# Altium schematic sheet INC-MBTMC429-01.SchDoc
size A1
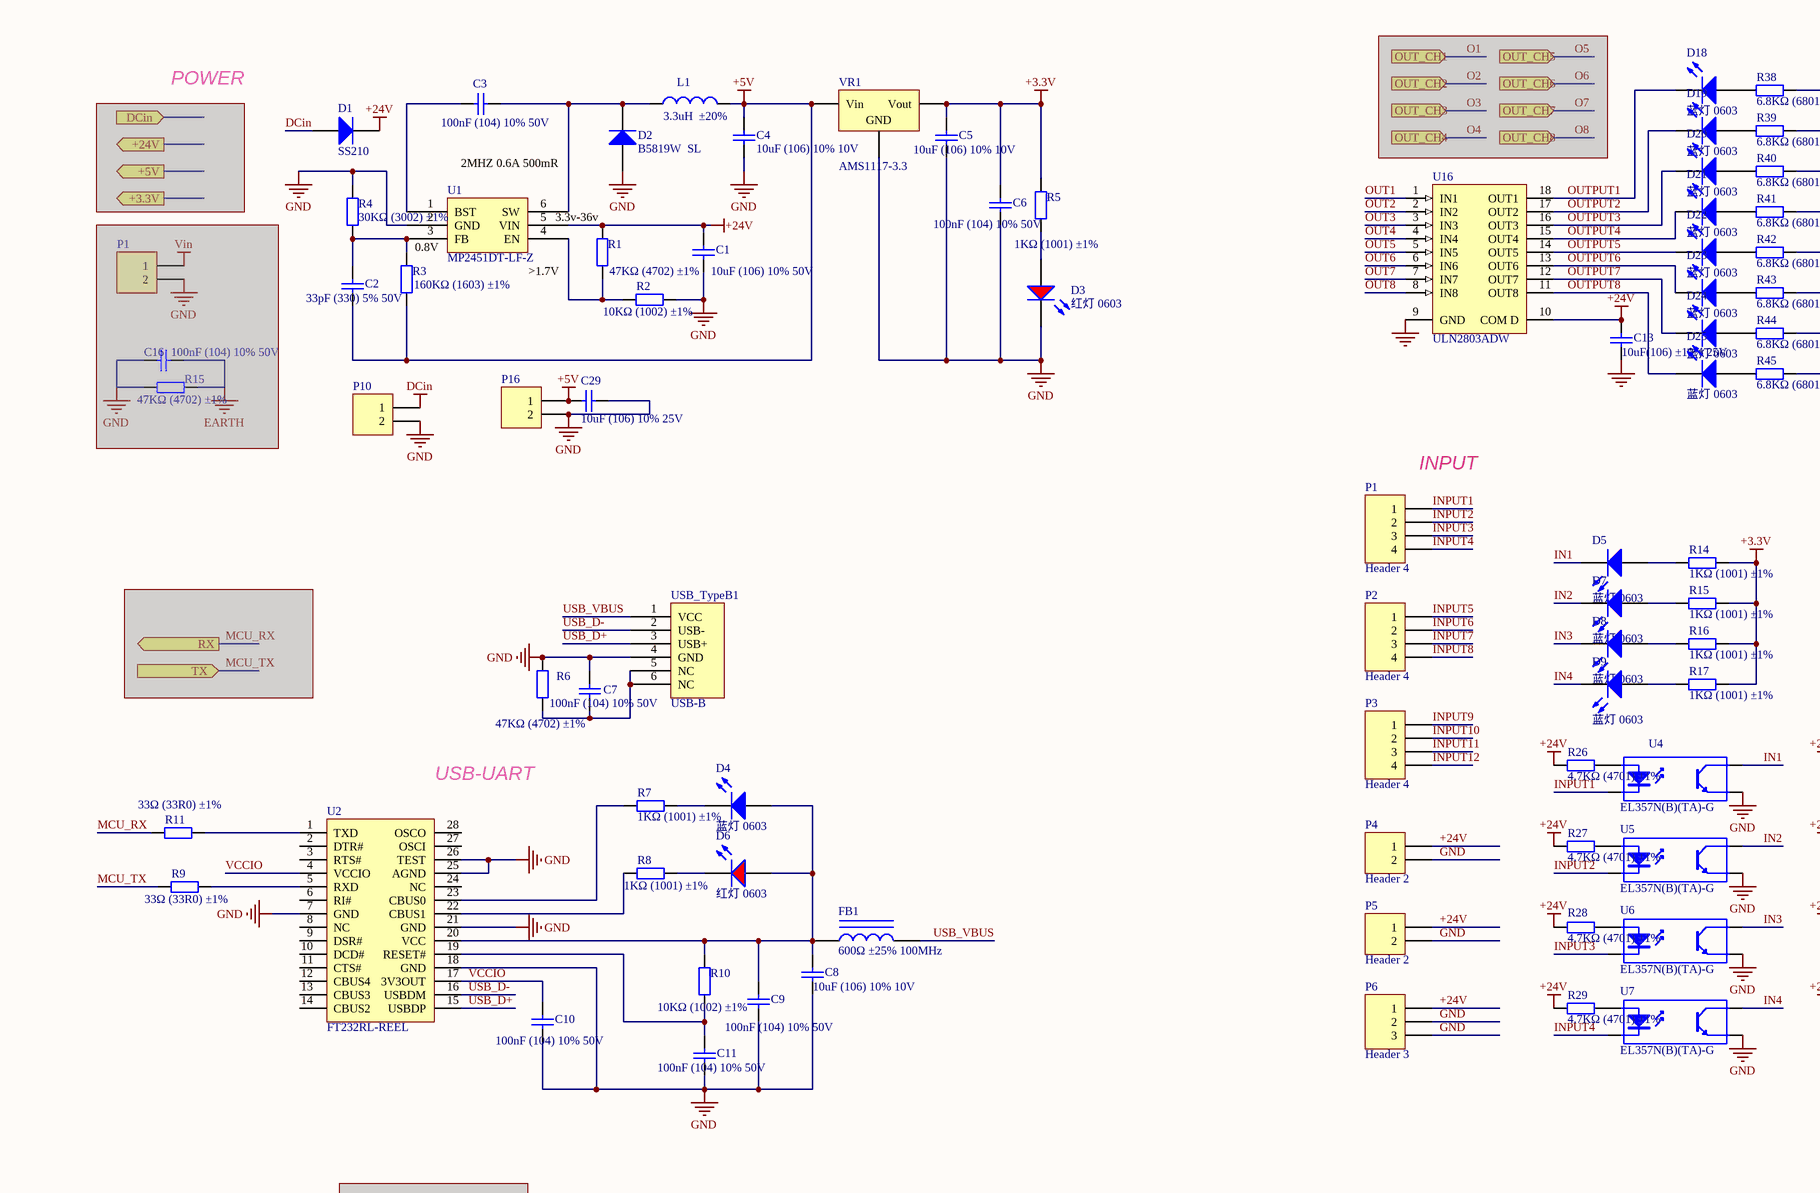
[diagram p0: INC-MBTMC429-01.SchDoc, top left]
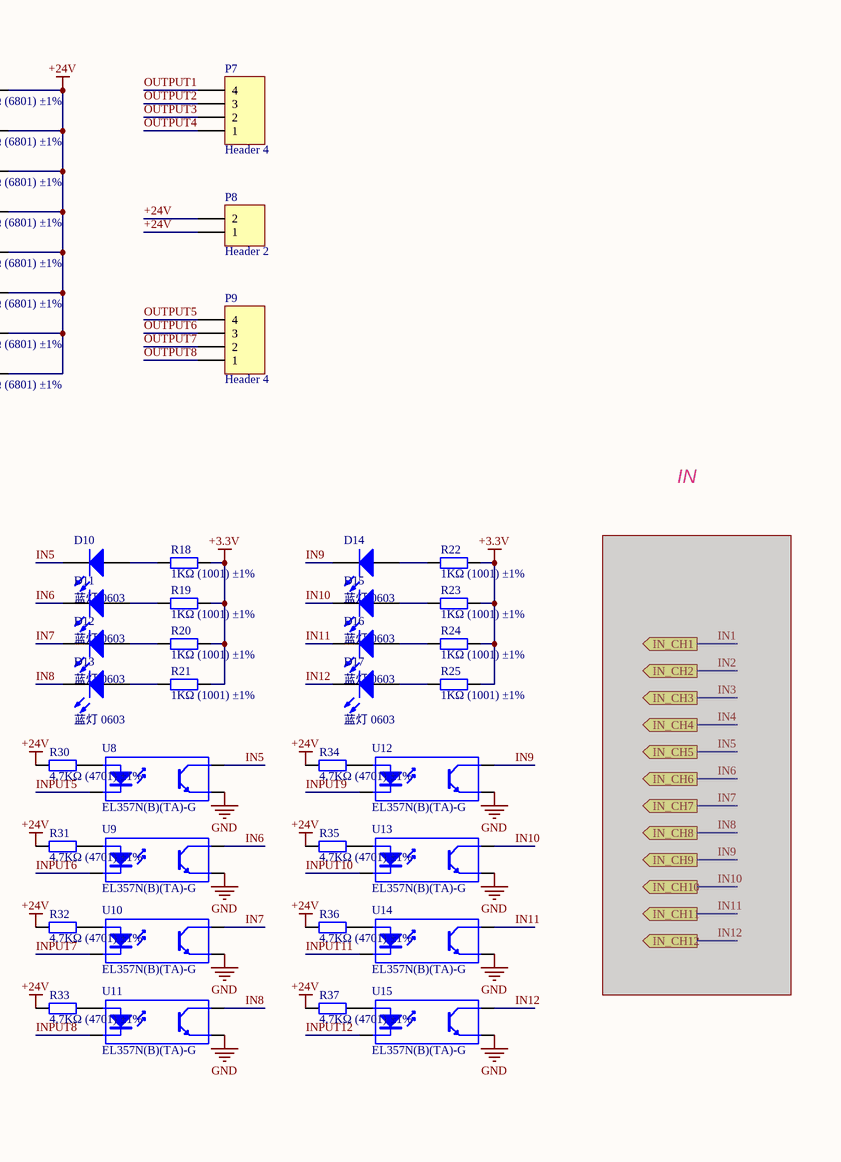
[diagram p1: INC-MBTMC429-01.SchDoc, top right]
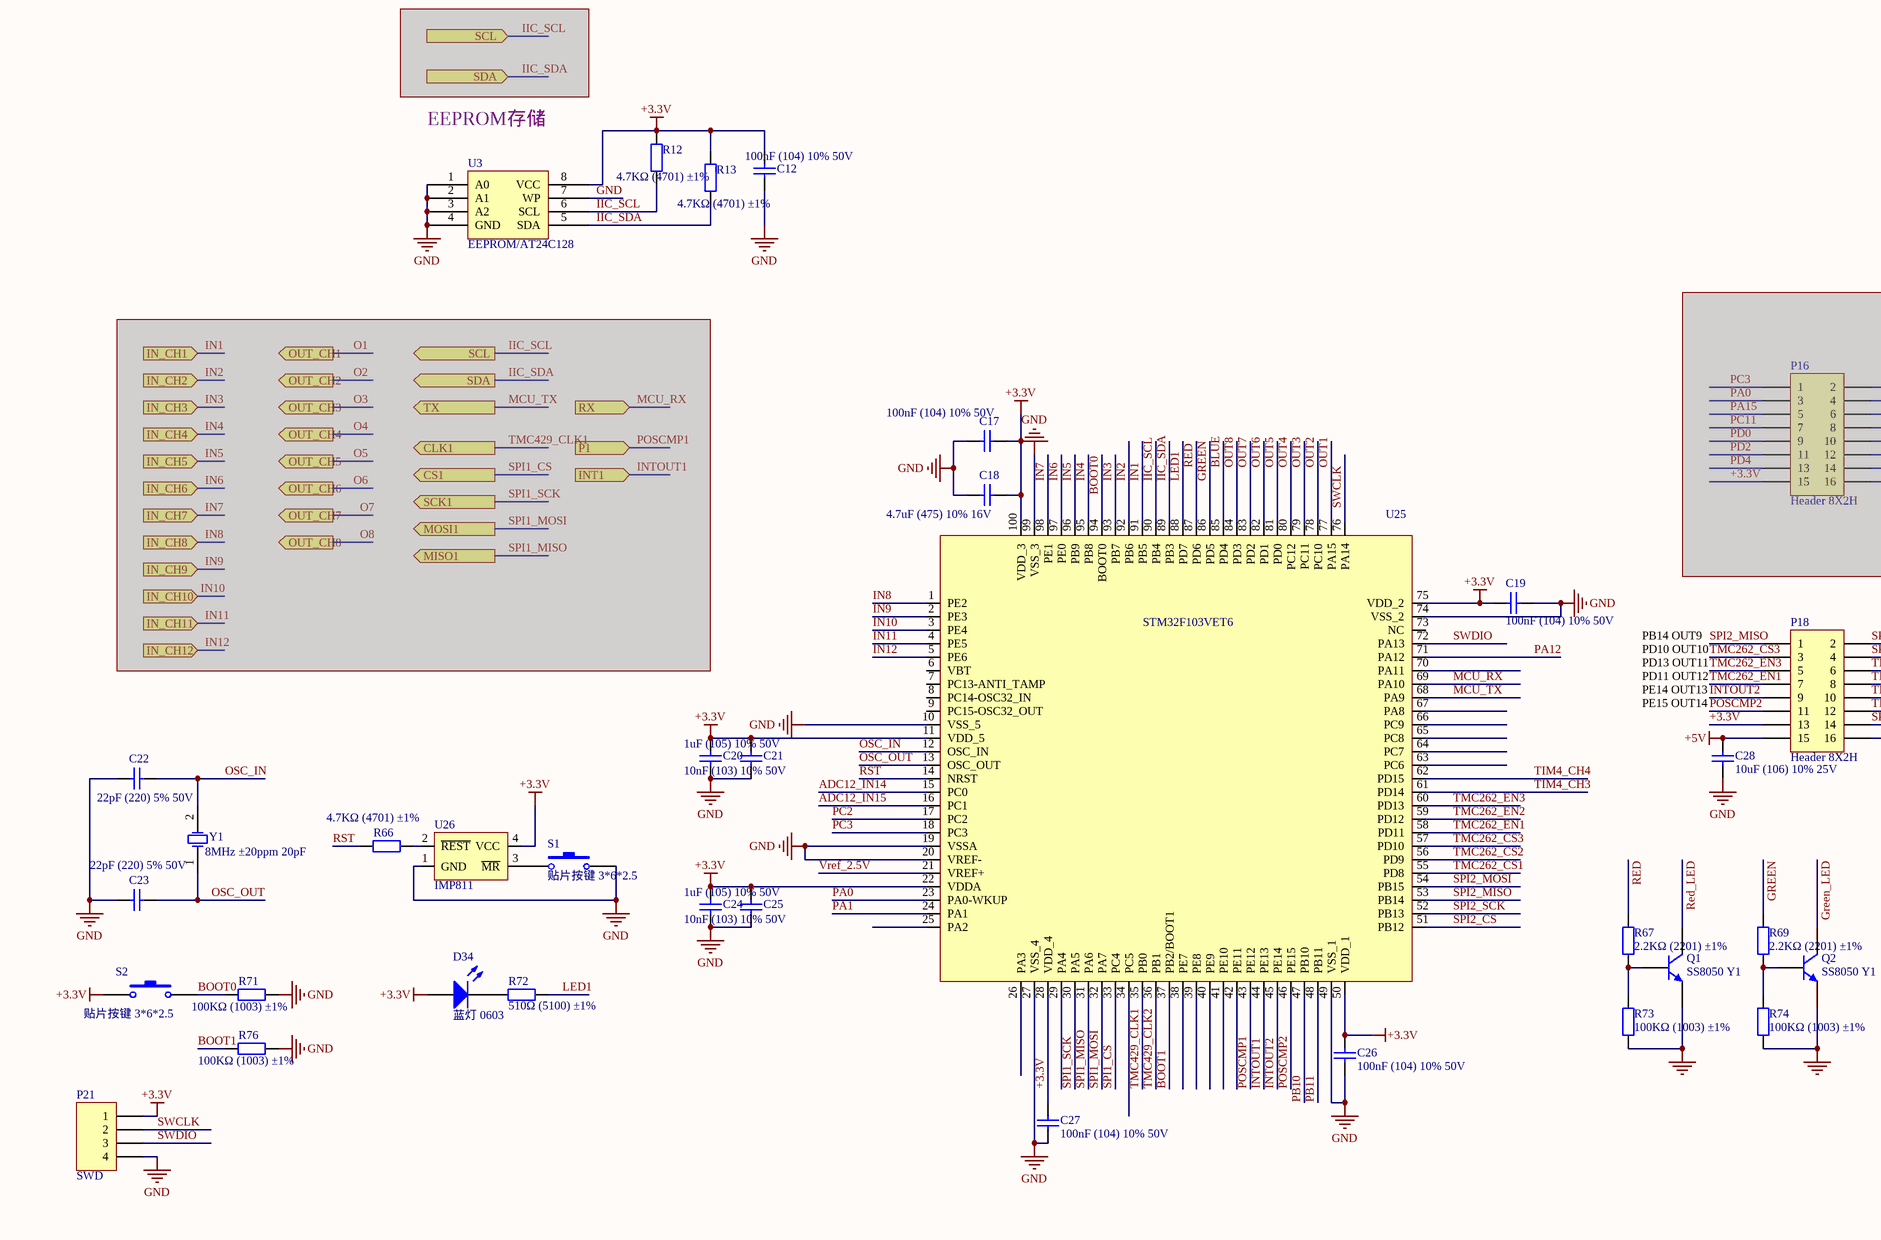
[diagram p2: INC-MBTMC429-01.SchDoc, bottom left]
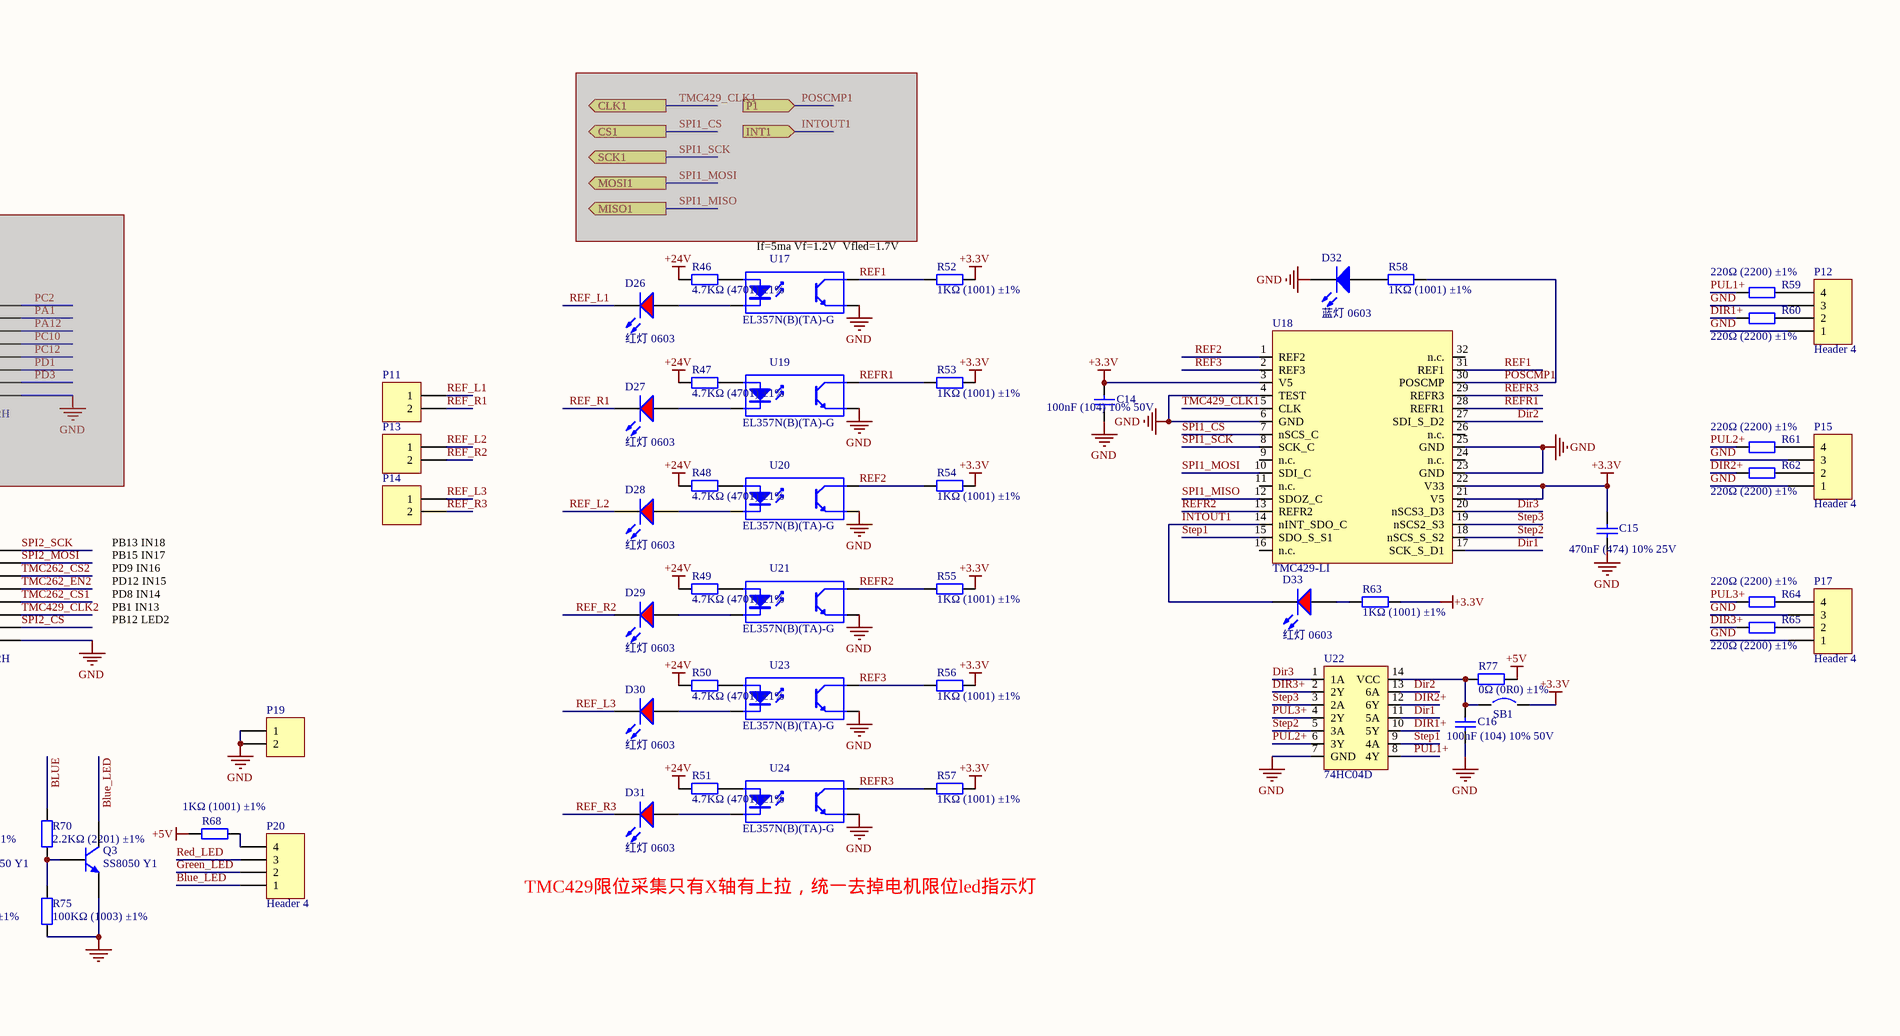
[diagram p3: INC-MBTMC429-01.SchDoc, bottom right]

## Parts
(Parts that share a designator on the sheet are numbered #1, #2 ... from top to bottom, then left to right.)
C1  10uF (106) 10% 50V  [1206_C]
C2  33pF (330) 5% 50V  [0603_C]
C3  100nF (104) 10% 50V  [0603_C]
C4  10uF (106) 10% 10V  [0603_C]
C5  10uF (106) 10% 10V  [0603_C]
C6  100nF (104) 10% 50V  [0603_C]
C7  100nF (104) 10% 50V  [0603_C]
C8  10uF (106) 10% 10V  [0603_C]
C9  100nF (104) 10% 50V  [0603_C]
C10  100nF (104) 10% 50V  [0603_C]
C11  100nF (104) 10% 50V  [0603_C]
C12  100nF (104) 10% 50V  [0603_C]
C13  10uF(106) ±10% 25V  [1206_C]
C14  100nF (104) 10% 50V  [0603_C]
C15  470nF (474) 10% 25V  [0603_C]
C16#1  100nF (104) 10% 50V  [0603_C]  (masked out: inside a compile mask, not in the netlist)
C16#2  100nF (104) 10% 50V  [0603_C]
C17  100nF (104) 10% 50V  [0603_C]
C18  4.7uF (475) 10% 16V  [0603_C]
C19  100nF (104) 10% 50V  [0603_C]
C20  1uF (105) 10% 50V  [0603_C]
C21  10nF (103) 10% 50V  [0603_C]
C22  22pF (220) 5% 50V  [0603_C]
C23  22pF (220) 5% 50V  [0603_C]
C24  1uF (105) 10% 50V  [0603_C]
C25  10nF (103) 10% 50V  [0603_C]
C26  100nF (104) 10% 50V  [0603_C]
C27  100nF (104) 10% 50V  [0603_C]
C28  10uF (106) 10% 25V  [0805_C]
C29  10uF (106) 10% 25V  [0805_C]
D1  SS210  [SMA(DO-214AC)_S1]
D2  B5819W  SL  [SOD-123]
D3  红灯 0603  [0603_LED_S1]
D4  蓝灯 0603  [0603_LED_S1]
D5  蓝灯 0603  [0603_LED_S1]
D6  红灯 0603  [0603_LED_S1]
D7  蓝灯 0603  [0603_LED_S1]
D8  蓝灯 0603  [0603_LED_S1]
D9  蓝灯 0603  [0603_LED_S1]
D10  蓝灯 0603  [0603_LED_S1]
D11  蓝灯 0603  [0603_LED_S1]
D12  蓝灯 0603  [0603_LED_S1]
D13  蓝灯 0603  [0603_LED_S1]
D14  蓝灯 0603  [0603_LED_S1]
D15  蓝灯 0603  [0603_LED_S1]
D16  蓝灯 0603  [0603_LED_S1]
D17  蓝灯 0603  [0603_LED_S1]
D18  蓝灯 0603  [0603_LED_S1]
D19  蓝灯 0603  [0603_LED_S1]
D20  蓝灯 0603  [0603_LED_S1]
D21  蓝灯 0603  [0603_LED_S1]
D22  蓝灯 0603  [0603_LED_S1]
D23  蓝灯 0603  [0603_LED_S1]
D24  蓝灯 0603  [0603_LED_S1]
D25  蓝灯 0603  [0603_LED_S1]
D26  红灯 0603  [0603_LED_S1]
D27  红灯 0603  [0603_LED_S1]
D28  红灯 0603  [0603_LED_S1]
D29  红灯 0603  [0603_LED_S1]
D30  红灯 0603  [0603_LED_S1]
D31  红灯 0603  [0603_LED_S1]
D32  蓝灯 0603  [0603_LED_S1]
D33  红灯 0603  [0603_LED_S1]
D34  蓝灯 0603  [0603_LED_S1]
FB1  600Ω ±25% 100MHz  [0805_L]
L1  3.3uH  ±20%  [L5020]
P1#1  Header 2  [15EDG-2P-3.81]  (value not drawn)  (masked out: inside a compile mask, not in the netlist)
P1#2  Header 4  [WJ15EDGVC-3.81-4P]
P2  Header 4  [WJ15EDGVC-3.81-4P]
P3  Header 4  [WJ15EDGVC-3.81-4P]
P4  Header 2  [WJ15EDGVC-3.81-2P]
P5  Header 2  [WJ15EDGVC-3.81-2P]
P6  Header 3  [WJ15EDGVC-3.81-3P]
P7  Header 4  [WJ15EDGVC-3.81-4P]
P8  Header 2  [WJ15EDGVC-3.81-2P]
P9  Header 4  [WJ15EDGVC-3.81-4P]
P10  Header 2  [WJ15EDGVC-3.81-2P]  (value not drawn)
P11  Header 2  [WJ15EDGVC-3.81-2P]  (value not drawn)
P12  Header 4  [WJ15EDGVC-3.81-4P]
P13  Header 2  [WJ15EDGVC-3.81-2P]  (value not drawn)
P14  Header 2  [WJ15EDGVC-3.81-2P]  (value not drawn)
P15  Header 4  [WJ15EDGVC-3.81-4P]
P16#1  Header 2  [WJ15EDGVC-3.81-2P]  (value not drawn)
P16#2  Header 8X2H  [直牛角连接器 2*8*2.54]  (masked out: inside a compile mask, not in the netlist)
P17  Header 4  [WJ15EDGVC-3.81-4P]
P18  Header 8X2H  [直牛角连接器 2*8*2.54]
P19  Header 2  [WJ15EDGVC-3.81-2P]  (value not drawn)
P20  Header 4  [WJ15EDGVC-3.81-4P]
P21  SWD  [XH连接器 4P-2.5]
Q1  SS8050 Y1  [SOT-23(SOT-23-3)]
Q2  SS8050 Y1  [SOT-23(SOT-23-3)]
Q3  SS8050 Y1  [SOT-23(SOT-23-3)]
R1  47KΩ (4702) ±1%  [0603_R]
R2  10KΩ (1002) ±1%  [0603_R]
R3  160KΩ (1603) ±1%  [0603_R]
R4  30KΩ (3002) ±1%  [0603_R]
R5  1KΩ (1001) ±1%  [0603_R]
R6  47KΩ (4702) ±1%  [0603_R]
R7  1KΩ (1001) ±1%  [0603_R]
R8  1KΩ (1001) ±1%  [0603_R]
R9  33Ω (33R0) ±1%  [0603_R]
R10  10KΩ (1002) ±1%  [0603_R]
R11  33Ω (33R0) ±1%  [0603_R]
R12  4.7KΩ (4701) ±1%  [0603_R]
R13  4.7KΩ (4701) ±1%  [0603_R]
R14  1KΩ (1001) ±1%  [0603_R]
R15#1  47KΩ (4702) ±1%  [0603_R]  (masked out: inside a compile mask, not in the netlist)
R15#2  1KΩ (1001) ±1%  [0603_R]
R16  1KΩ (1001) ±1%  [0603_R]
R17  1KΩ (1001) ±1%  [0603_R]
R18  1KΩ (1001) ±1%  [0603_R]
R19  1KΩ (1001) ±1%  [0603_R]
R20  1KΩ (1001) ±1%  [0603_R]
R21  1KΩ (1001) ±1%  [0603_R]
R22  1KΩ (1001) ±1%  [0603_R]
R23  1KΩ (1001) ±1%  [0603_R]
R24  1KΩ (1001) ±1%  [0603_R]
R25  1KΩ (1001) ±1%  [0603_R]
R26  4.7KΩ (4701) ±1%  [1206_R]
R27  4.7KΩ (4701) ±1%  [1206_R]
R28  4.7KΩ (4701) ±1%  [1206_R]
R29  4.7KΩ (4701) ±1%  [1206_R]
R30  4.7KΩ (4701) ±1%  [1206_R]
R31  4.7KΩ (4701) ±1%  [1206_R]
R32  4.7KΩ (4701) ±1%  [1206_R]
R33  4.7KΩ (4701) ±1%  [1206_R]
R34  4.7KΩ (4701) ±1%  [1206_R]
R35  4.7KΩ (4701) ±1%  [1206_R]
R36  4.7KΩ (4701) ±1%  [1206_R]
R37  4.7KΩ (4701) ±1%  [1206_R]
R38  6.8KΩ (6801) ±1%  [0603_R]
R39  6.8KΩ (6801) ±1%  [0603_R]
R40  6.8KΩ (6801) ±1%  [0603_R]
R41  6.8KΩ (6801) ±1%  [0603_R]
R42  6.8KΩ (6801) ±1%  [0603_R]
R43  6.8KΩ (6801) ±1%  [0603_R]
R44  6.8KΩ (6801) ±1%  [0603_R]
R45  6.8KΩ (6801) ±1%  [0603_R]
R46  4.7KΩ (4701) ±1%  [1206_R]
R47  4.7KΩ (4701) ±1%  [1206_R]
R48  4.7KΩ (4701) ±1%  [1206_R]
R49  4.7KΩ (4701) ±1%  [1206_R]
R50  4.7KΩ (4701) ±1%  [1206_R]
R51  4.7KΩ (4701) ±1%  [1206_R]
R52  1KΩ (1001) ±1%  [0603_R]
R53  1KΩ (1001) ±1%  [0603_R]
R54  1KΩ (1001) ±1%  [0603_R]
R55  1KΩ (1001) ±1%  [0603_R]
R56  1KΩ (1001) ±1%  [0603_R]
R57  1KΩ (1001) ±1%  [0603_R]
R58  1KΩ (1001) ±1%  [0603_R]
R59  220Ω (2200) ±1%  [0603_R]
R60  220Ω (2200) ±1%  [0603_R]
R61  220Ω (2200) ±1%  [0603_R]
R62  220Ω (2200) ±1%  [0603_R]
R63  1KΩ (1001) ±1%  [0603_R]
R64  220Ω (2200) ±1%  [0603_R]
R65  220Ω (2200) ±1%  [0603_R]
R66  4.7KΩ (4701) ±1%  [0603_R]
R67  2.2KΩ (2201) ±1%  [0603_R]
R68  1KΩ (1001) ±1%  [0805_R]
R69  2.2KΩ (2201) ±1%  [0603_R]
R70  2.2KΩ (2201) ±1%  [0603_R]
R71  100KΩ (1003) ±1%  [0603_R]
R72  510Ω (5100) ±1%  [0603_R]
R73  100KΩ (1003) ±1%  [0603_R]
R74  100KΩ (1003) ±1%  [0603_R]
R75  100KΩ (1003) ±1%  [0603_R]
R76  100KΩ (1003) ±1%  [0603_R]
R77  0Ω (0R0) ±1%  [0603_R]
S1  贴片按键 3*6*2.5  [贴片按键 3*6*2.5]
S2  贴片按键 3*6*2.5  [贴片按键 3*6*2.5]
SB1  Circuit Breaker  [JP2_SMD]  (value not drawn)
U1  MP2451DT-LF-Z  [SOT-23-6]
U2  FT232RL-REEL  [SSOP-28_208mil]
U3  EEPROM/AT24C128  [SOIC-8_150mil]
U4  EL357N(B)(TA)-G  [SOP-4_P2.54]
U5  EL357N(B)(TA)-G  [SOP-4_P2.54]
U6  EL357N(B)(TA)-G  [SOP-4_P2.54]
U7  EL357N(B)(TA)-G  [SOP-4_P2.54]
U8  EL357N(B)(TA)-G  [SOP-4_P2.54]
U9  EL357N(B)(TA)-G  [SOP-4_P2.54]
U10  EL357N(B)(TA)-G  [SOP-4_P2.54]
U11  EL357N(B)(TA)-G  [SOP-4_P2.54]
U12  EL357N(B)(TA)-G  [SOP-4_P2.54]
U13  EL357N(B)(TA)-G  [SOP-4_P2.54]
U14  EL357N(B)(TA)-G  [SOP-4_P2.54]
U15  EL357N(B)(TA)-G  [SOP-4_P2.54]
U16  ULN2803ADW  [SOIC-18_300mil]
U17  EL357N(B)(TA)-G  [SOP-4_P2.54]
U18  TMC429-LI  [QFN-32_5x5x05P]
U19  EL357N(B)(TA)-G  [SOP-4_P2.54]
U20  EL357N(B)(TA)-G  [SOP-4_P2.54]
U21  EL357N(B)(TA)-G  [SOP-4_P2.54]
U22  74HC04D  [SOIC-14_150mil]
U23  EL357N(B)(TA)-G  [SOP-4_P2.54]
U24  EL357N(B)(TA)-G  [SOP-4_P2.54]
U25  STM32F103VET6  [LQFP-100_14x14x05P]
U26  IMP811  [SOT-143]
USB_TypeB1  USB-B  [USB_TypeB]
VR1  AMS1117-3.3  [SOT-223]
Y1  8MHz ±20ppm 20pF  [SMD-5032_2P]

## Ports
+3.3V (out), +5V (out), +24V (out), CLK1 (out), CS1 (out), DCin (in), IN_CH1 (in), IN_CH1 (out), IN_CH2 (in), IN_CH2 (out), IN_CH3 (in), IN_CH3 (out), IN_CH4 (in), IN_CH4 (out), IN_CH5 (in), IN_CH5 (out), IN_CH6 (in), IN_CH6 (out), IN_CH7 (in), IN_CH7 (out), IN_CH8 (in), IN_CH8 (out), IN_CH9 (in), IN_CH9 (out), IN_CH10 (in), IN_CH10 (out), IN_CH11 (in), IN_CH11 (out), IN_CH12 (in), IN_CH12 (out), INT1 (in), MISO1 (out), MOSI1 (out), OUT_CH1 (in), OUT_CH1 (out), OUT_CH2 (in), OUT_CH2 (out), OUT_CH3 (in), OUT_CH3 (out), OUT_CH4 (in), OUT_CH4 (out), OUT_CH5 (in), OUT_CH5 (out), OUT_CH6 (in), OUT_CH6 (out), OUT_CH7 (in), OUT_CH7 (out), OUT_CH8 (in), OUT_CH8 (out), P1 (in), RX (in), RX (out), SCK1 (out), SCL (in), SCL (out), SDA (in), SDA (out), TX (in), TX (out)

## Nets
+3.3V: C5.1 C6.2 C12.2 C14.2 C15.2 C17.2 C18.2 C19.2 C20.2 C21.2 C24.2 C25.2 C26.2 C27.2 D34.A P18.13 P21.1 R5.1 R12.2 R13.2 R14.1 R15#2.1 R16.1 R17.1 R18.1 R19.1 R20.1 R21.1 R22.1 R23.1 R24.1 R25.1 R52.1 R53.1 R54.1 R55.1 R56.1 R57.1 R63.2 S2.1 SB1.2 U3.8(VCC) U18.3(V5) U18.21(V5) U18.22(V33) U25.11(VDD_5) U25.22(VDDA) U25.28(VDD_4) U25.50(VDD_1) U25.75(VDD_2) U25.100(VDD_3) U26.4(VCC) VR1.2(Vout)
+5V: C2.1 C4.2 C28.2 C29.2 L1.2 P16#1.1 P18.15 R3.1 R68.1 R77.1 VR1.3(Vin)
+24V: C1.2 C13.2 D1.2(K) P4.1 P5.1 P6.1 P8.1 P8.2 R1.2 R26.1 R27.1 R28.1 R29.1 R30.1 R31.1 R32.1 R33.1 R34.1 R35.1 R36.1 R37.1 R38.2 R39.2 R40.2 R41.2 R42.2 R43.2 R44.2 R45.2 R46.1 R47.1 R48.1 R49.1 R50.1 R51.1 U1.5(VIN) U16.10(COM_D)
DCin: D1.1(A) P10.1
GND: C1.1 C4.1 C5.2 C6.1 C7.2 C8.1 C9.1 C10.2 C11.2 C12.1 C13.1 C14.1 C15.1 C16#2.2 C17.1 C18.1 C19.1 C20.1 C21.1 C22.1 C23.1 C24.1 C25.1 C26.1 C27.1 C28.1 C29.1 D2.1(A) D3.K D32.K P4.2 P5.2 P6.2 P6.3 P10.2 P12.1 P12.3 P15.1 P15.3 P16#1.2 P17.1 P17.3 P18.16 P19.1 P19.2 P21.4 Q1.2(E) Q2.2(E) Q3.2(E) R2.2 R4.2 R6.2 R71.2 R73.1 R74.1 R75.1 R76.2 S1.2 U1.2(GND) U2.7(GND) U2.18(GND) U2.21(GND) U2.25(AGND) U2.26(TEST) U3.1(A0) U3.2(A1) U3.3(A2) U3.4(GND) U3.7(WP) U4.3(E) U5.3(E) U6.3(E) U7.3(E) U8.3(E) U9.3(E) U10.3(E) U11.3(E) U12.3(E) U13.3(E) U14.3(E) U15.3(E) U16.9(GND) U17.3(E) U18.4(TEST) U18.6(GND) U18.23(GND) U18.25(GND) U19.3(E) U20.3(E) U21.3(E) U22.7(GND) U23.3(E) U24.3(E) U25.10(VSS_5) U25.19(VSSA) U25.20(VREF-) U25.27(VSS_4) U25.49(VSS_1) U25.74(VSS_2) U25.99(VSS_3) U26.1(GND) USB_TypeB1.4(GND) VR1.1(GND)
ADC12_IN14: U25.15(PC0)
ADC12_IN15: U25.16(PC1)
BLUE: R70.2 U25.85(PD4)
Blue_LED: P20.1 Q3.3(C)
BOOT0: R71.1 S2.2 U25.94(BOOT0)
BOOT1: R76.1 U25.37(PB2/BOOT1)
Dir1: U18.17(SCK_S_D1) U22.11(5A)
DIR1+: R60.1 U22.10(5Y)
Dir2: U18.27(SDI_S_D2) U22.13(6A)
DIR2+: R62.1 U22.12(6Y)
Dir3: U18.20(nSCS3_D3) U22.1(1A)
DIR3+: R65.1 U22.2(2Y)
GREEN: R69.2 U25.86(PD5)
Green_LED: P20.2 Q2.3(C)
IIC_SCL: R12.1 U3.6(SCL) U25.90(PB4)
IIC_SDA: R13.1 U3.5(SDA) U25.89(PB3)
IN1: D5.K U4.4(C) U25.91(PB5)
IN2: D7.K U5.4(C) U25.92(PB6)
IN3: D8.K U6.4(C) U25.93(PB7)
IN4: D9.K U7.4(C) U25.95(PB8)
IN5: D10.K U8.4(C) U25.96(PB9)
IN6: D11.K U9.4(C) U25.97(PE0)
IN7: D12.K U10.4(C) U25.98(PE1)
IN8: D13.K U11.4(C) U25.1(PE2)
IN9: D14.K U12.4(C) U25.2(PE3)
IN10: D15.K U13.4(C) U25.3(PE4)
IN11: D16.K U14.4(C) U25.4(PE5)
IN12: D17.K U15.4(C) U25.5(PE6)
INPUT1: P1#2.1 U4.2(K)
INPUT2: P1#2.2 U5.2(K)
INPUT3: P1#2.3 U6.2(K)
INPUT4: P1#2.4 U7.2(K)
INPUT5: P2.1 U8.2(K)
INPUT6: P2.2 U9.2(K)
INPUT7: P2.3 U10.2(K)
INPUT8: P2.4 U11.2(K)
INPUT9: P3.1 U12.2(K)
INPUT10: P3.2 U13.2(K)
INPUT11: P3.3 U14.2(K)
INPUT12: P3.4 U15.2(K)
INTOUT1: D33.K U18.14(nINT_SDO_C) U25.44(PE13)
INTOUT2: P18.9 U25.45(PE14)
LED1: R72.2 U25.88(PD7)
MCU_RX: R11.1 U25.69(PA10)
MCU_TX: R9.1 U25.68(PA9)
OSC_IN: C22.2 U25.12(OSC_IN) Y1.2(OSC2)
OSC_OUT: C23.2 U25.13(OSC_OUT) Y1.1(OSC1)
OUT1: U16.1(IN1) U25.77(PA15)
OUT2: U16.2(IN2) U25.78(PC10)
OUT3: U16.3(IN3) U25.79(PC11)
OUT4: U16.4(IN4) U25.80(PC12)
OUT5: U16.5(IN5) U25.81(PD0)
OUT6: U16.6(IN6) U25.82(PD1)
OUT7: U16.7(IN7) U25.83(PD2)
OUT8: U16.8(IN8) U25.84(PD3)
OUTPUT1: D18.K P7.4 U16.18(OUT1)
OUTPUT2: D19.K P7.3 U16.17(OUT2)
OUTPUT3: D20.K P7.2 U16.16(OUT3)
OUTPUT4: D21.K P7.1 U16.15(OUT4)
OUTPUT5: D22.K P9.4 U16.14(OUT5)
OUTPUT6: D23.K P9.3 U16.13(OUT6)
OUTPUT7: D24.K P9.2 U16.12(OUT7)
OUTPUT8: D25.K P9.1 U16.11(OUT8)
PA0: U25.23(PA0-WKUP)
PA1: U25.24(PA1)
PA12: U25.71(PA12)
PB10: U25.47(PB10)
PB11: U25.48(PB11)
PC2: U25.17(PC2)
PC3: U25.18(PC3)
POSCMP1: R58.2 U18.30(POSCMP) U25.43(PE12)
POSCMP2: P18.11 U25.46(PE15)
PUL1+: R59.1 U22.8(4Y)
PUL2+: R61.1 U22.6(3Y)
PUL3+: R64.1 U22.4(2Y)
RED: R67.2 U25.87(PD6)
Red_LED: P20.3 Q1.3(C)
REF1: R52.2 U17.4(C) U18.31(REF1)
REF2: R54.2 U18.1(REF2) U20.4(C)
REF3: R56.2 U18.2(REF3) U23.4(C)
REF_L1: D26.K P11.1
REF_L2: D28.K P13.1
REF_L3: D30.K P14.1
REF_R1: D27.K P11.2
REF_R2: D29.K P13.2
REF_R3: D31.K P14.2
REFR1: R53.2 U18.28(REFR1) U19.4(C)
REFR2: R55.2 U18.13(REFR2) U21.4(C)
REFR3: R57.2 U18.29(REFR3) U24.4(C)
RST: R66.1 U25.14(NRST)
SPI1_CS: U18.7(nSCS_C) U25.33(PC4)
SPI1_MISO: U18.12(SDOZ_C) U25.31(PA6)
SPI1_MOSI: U18.10(SDI_C) U25.32(PA7)
SPI1_SCK: U18.8(SCK_C) U25.30(PA5)
SPI2_CS: P18.14 U25.51(PB12)
SPI2_MISO: P18.1 U25.53(PB14)
SPI2_MOSI: P18.4 U25.54(PB15)
SPI2_SCK: P18.2 U25.52(PB13)
Step1: U18.15(SDO_S_S1) U22.9(4A)
Step2: U18.18(nSCS_S_S2) U22.5(3A)
Step3: U18.19(nSCS2_S3) U22.3(2A)
SWCLK: P21.2 U25.76(PA14)
SWDIO: P21.3 U25.72(PA13)
TIM4_CH3: U25.61(PD14)
TIM4_CH4: U25.62(PD15)
TMC262_CS1: P18.10 U25.55(PD8)
TMC262_CS2: P18.6 U25.56(PD9)
TMC262_CS3: P18.3 U25.57(PD10)
TMC262_EN1: P18.7 U25.58(PD11)
TMC262_EN2: P18.8 U25.59(PD12)
TMC262_EN3: P18.5 U25.60(PD13)
TMC429_CLK1: U18.5(CLK) U25.35(PB0)
TMC429_CLK2: P18.12 U25.36(PB1)
USB_D+: U2.15(USBDP) USB_TypeB1.3(USB+)
USB_D-: U2.16(USBDM) USB_TypeB1.2(USB-)
USB_VBUS: FB1.2 USB_TypeB1.1(VCC)
VCCIO: C10.1 U2.4(VCCIO) U2.17(3V3OUT)
Vref_2.5V: U25.21(VREF+)
NetC2_2: C2.2 R3.2 R4.1 U1.3(FB)
NetC3_1: C3.1 U1.1(BST)
NetC3_2: C3.2 D2.2(K) L1.1 U1.6(SW)
NetC7_1: C7.1 R6.1 USB_TypeB1.5(NC) USB_TypeB1.6(NC)
NetC8_2: C8.2 C9.2 D4.A D6.A FB1.1 R10.2 U2.20(VCC)
NetC11_1: C11.1 R10.1 U2.19(RESET#)
NetC16#2_1: C16#2.1 R77.2 SB1.1 U22.14(VCC)
NetD3_A: D3.A R5.2
NetD4_K: D4.K R7.1
NetD5_A: D5.A R14.2
NetD6_K: D6.K R8.2
NetD7_A: D7.A R15#2.2
NetD8_A: D8.A R16.2
NetD9_A: D9.A R17.2
NetD10_A: D10.A R18.2
NetD11_A: D11.A R19.2
NetD12_A: D12.A R20.2
NetD13_A: D13.A R21.2
NetD14_A: D14.A R22.2
NetD15_A: D15.A R23.2
NetD16_A: D16.A R24.2
NetD17_A: D17.A R25.2
NetD18_A: D18.A R38.1
NetD19_A: D19.A R39.1
NetD20_A: D20.A R40.1
NetD21_A: D21.A R41.1
NetD22_A: D22.A R42.1
NetD23_A: D23.A R43.1
NetD24_A: D24.A R44.1
NetD25_A: D25.A R45.1
NetD26_A: D26.A U17.2(K)
NetD27_A: D27.A U19.2(K)
NetD28_A: D28.A U20.2(K)
NetD29_A: D29.A U21.2(K)
NetD30_A: D30.A U23.2(K)
NetD31_A: D31.A U24.2(K)
NetD32_A: D32.A R58.1
NetD33_A: D33.A R63.1
NetD34_K: D34.K R72.1
NetP12_2: P12.2 R60.2
NetP12_4: P12.4 R59.2
NetP15_2: P15.2 R62.2
NetP15_4: P15.4 R61.2
NetP17_2: P17.2 R65.2
NetP17_4: P17.4 R64.2
NetP20_4: P20.4 R68.2
NetQ1_1: Q1.1(B) R67.1 R73.2
NetQ2_1: Q2.1(B) R69.1 R74.2
NetQ3_1: Q3.1(B) R70.1 R75.2
NetR1_1: R1.1 R2.1 U1.4(EN)
NetR7_2: R7.2 U2.23(CBUS0)
NetR8_1: R8.1 U2.22(CBUS1)
NetR9_2: R9.2 U2.5(RXD)
NetR11_2: R11.2 U2.1(TXD)
NetR26_2: R26.2 U4.1(A)
NetR27_2: R27.2 U5.1(A)
NetR28_2: R28.2 U6.1(A)
NetR29_2: R29.2 U7.1(A)
NetR30_2: R30.2 U8.1(A)
NetR31_2: R31.2 U9.1(A)
NetR32_2: R32.2 U10.1(A)
NetR33_2: R33.2 U11.1(A)
NetR34_2: R34.2 U12.1(A)
NetR35_2: R35.2 U13.1(A)
NetR36_2: R36.2 U14.1(A)
NetR37_2: R37.2 U15.1(A)
NetR46_2: R46.2 U17.1(A)
NetR47_2: R47.2 U19.1(A)
NetR48_2: R48.2 U20.1(A)
NetR49_2: R49.2 U21.1(A)
NetR50_2: R50.2 U23.1(A)
NetR51_2: R51.2 U24.1(A)
NetR66_2: R66.2 U26.2(~{REST})
NetS1_1: S1.1 U26.3(~{MR})

Not connected (* = marked no-connect by the designer): U2 2(DTR#) 3(RTS#) 6(RI#) 8(NC) 9(DSR#) 10(DCD#) 11(CTS#) 12(CBUS4) 13(CBUS3) 14(CBUS2) 24(NC) 27(OSCI) 28(OSCO); U18 9(n.c.) 11(n.c.) 16(n.c.) 24(n.c.) 26(n.c.) 32(n.c.); U25 6(VBT) 7(PC13-ANTI_TAMP) 8(PC14-OSC32_IN) 9(PC15-OSC32_OUT) 25(PA2) 26(PA3) 29(PA4) 34(PC5) 38(PE7) 39(PE8) 40(PE9) 41(PE10) 42(PE11) 63(PC6) 64(PC7) 65(PC8) 66(PC9) 67(PA8) 70(PA11) 73(NC)

## Notes on the sheet
- POWER
- 2MHZ 0.6A 500mR
- 0.8V
- >1.7V
- (near R1) 3.3v-36v
- (near P1#2) INPUT
- IN
- (near U2) USB-UART
- EEPROM存储
- If=5ma Vf=1.2V  Vfled=1.7V
- PB14 OUT9
- PD10 OUT10
- PB15 IN17
- PB13 IN18
- (near C28) PE15 OUT14
- PE14 OUT13
- PD11 OUT12
- PD13 OUT11
- PB12 LED2
- PB1 IN13
- PD8 IN14
- PD12 IN15
- PD9 IN16
- TMC429限位采集只有X轴有上拉，统一去掉电机限位led指示灯

## Library data of the parts
C1 = 1206 10uF (106) 10% 50V: 贴片电容; ComponentLink1Description: 供应商链接; ComponentLink1URL: http://www.szlcsc.com/product/details_14236.html; Package: 1206; Supplier: LC; SuppliersPartNumber: C13585
C2 = 0603 33pF (330) 5% 50V: 贴片电容; ComponentLink1Description: 供应商链接; ComponentLink1URL: http://www.szlcsc.com/product/details_2015.html; Package: 0603; Supplier: LC; SuppliersPartNumber: C1663
C3 C6 C7 C9-C12 C14 C16#2 C17 C19 C26 C27 = 0603 100nF (104) 10% 50V: 贴片电容; ComponentLink1Description: 供应商链接; ComponentLink1URL: http://www.szlcsc.com/product/details_15331.html; Package: 0603; Supplier: LC; SuppliersPartNumber: C14663
C4 C5 C8 = 0603 10uF (106) 10% 10V: 贴片电容; ComponentLink1Description: 供应商链接; ComponentLink1URL: http://www.szlcsc.com/product/details_20411.html; Package: 0603; Supplier: LC; SuppliersPartNumber: C19702
C13 C16#1 = Cap: Capacitor; Published: 8-Jun-2000; LatestRevisionDate: 17-Jul-2002; LatestRevisionNote: Re-released for DXP Platform.; PackageReference: RAD-0.3; Publisher: Altium Limited
  C13: Value: 10uF(106) ±10% 25V
  C16#1: Value: 100nF (104) 10% 50V
C15 = 0603 470nF (474) 10% 25V: 贴片电容; ComponentLink1Description: 供应商链接; ComponentLink1URL: http://www.szlcsc.com/product/details_1975.html; Package: 0603; Supplier: LC; SuppliersPartNumber: C1623
C18 = 0603 4.7uF (475) 10% 16V: 贴片电容; ComponentLink1Description: 供应商链接; ComponentLink1URL: http://www.szlcsc.com/product/details_20375.html; Package: 0603; Supplier: LC; SuppliersPartNumber: C19666
C20 C24 = 0603 1uF (105) 10% 50V: 贴片电容; ComponentLink1Description: 供应商链接; ComponentLink1URL: http://www.szlcsc.com/product/details_16531.html; Package: 0603; Supplier: LC; SuppliersPartNumber: C15849
C21 C25 = 0603 10nF (103) 10% 50V: 贴片电容; ComponentLink1Description: 供应商链接; ComponentLink1URL: http://www.szlcsc.com/product/details_58143.html; Package: 0603; Supplier: LC; SuppliersPartNumber: C57112
C22 C23 = 0603 22pF (220) 5% 50V: 贴片电容; ComponentLink1Description: 供应商链接; ComponentLink1URL: http://www.szlcsc.com/product/details_2005.html; Package: 0603; Supplier: LC; SuppliersPartNumber: C1653
C28 C29 = 0805 10uF (106) 10% 25V: 贴片电容; ComponentLink1Description: 供应商链接; ComponentLink1URL: http://www.szlcsc.com/product/details_16532.html; Package: 0805; Supplier: LC; SuppliersPartNumber: C15850
D1 = SMA(DO-214AC) SS210: 二极管; ComponentLink1Description: 供应商链接; ComponentLink1URL: http://www.szlcsc.com/product/details_15669.html; Package: SMA(DO-214AC); Supplier: LC; SuppliersPartNumber: C14996
D2 = SOD-123 B5819W  SL: 肖特基二极管; ComponentLink1Description: 供应商链接; ComponentLink1URL: http://www.szlcsc.com/product/details_9093.html; Package: SOD-123; Supplier: LC; SuppliersPartNumber: C8598
D3 D6 D26-D31 D33 = 0603 红灯: 发光二极管; ComponentLink1Description: 供应商链接; ComponentLink1URL: http://www.szlcsc.com/product/details_2659.html; Package: 0603; Supplier: LC; SuppliersPartNumber: C2286
D4 D5 D7-D25 D32 D34 = 0603 蓝灯: 发光二极管; ComponentLink1Description: 供应商链接; ComponentLink1URL: http://www.szlcsc.com/product/details_73150.html; Package: 0603; Supplier: LC; SuppliersPartNumber: C72041
FB1 = 0805 600Ω 25% 100MHz: 贴片磁珠; ComponentLink1Description: 供应商链接; ComponentLink1URL: http://www.szlcsc.com/product/details_1369.html; Package: 0805; Supplier: LC; SuppliersPartNumber: C1017
L1 = Inductor: Code_IEC: 1005; Value: 4.7uH  ±10%; Published: 8-Jun-2000; LatestRevisionDate: 29-May-2009; LatestRevisionNote: IPC-7351 Footprint Added.; PackageReference: 0402-A; Publisher: Altium Limited; PackageDescription: Chip Inductor; Code_JEITA: 0402
P1#1 P4 P5 P8 P10 P11 P13 P14 P16#1 P19 = Header 2: Header, 2-Pin; LatestRevisionDate: 17-Jul-2002; LatestRevisionNote: Re-released for DXP Platform.; Publisher: Altium Limited
P1#2 P2 P3 P7 P9 P12 P15 P17 P20 = Header 4: Header, 4-Pin; LatestRevisionDate: 17-Jul-2002; LatestRevisionNote: Re-released for DXP Platform.; Publisher: Altium Limited
P6 = Header 3: Header, 3-Pin; LatestRevisionDate: 17-Jul-2002; LatestRevisionNote: Re-released for DXP Platform.; Publisher: Altium Limited
P16#2 P18 = Header 8X2H: Header, 8-Pin, Dual row, Right Angle; LatestRevisionDate: 17-Jul-2002; LatestRevisionNote: Re-released for DXP Platform.; Publisher: Altium Limited
P21 = MHDR1X4: Header, 4-Pin; LatestRevisionDate: 17-Jul-2002; LatestRevisionNote: Re-released for DXP Platform.; Publisher: Altium Limited
Q1-Q3 = SOT-23 SS8050 Y1: 三极管; ComponentLink1Description: 供应商链接; ComponentLink1URL: http://www.szlcsc.com/product/details_2507.html; Package: SOT-23; Supplier: LC; SuppliersPartNumber: C2150
R1 R6 = 0603 47KΩ (4702) 1%: 贴片电阻; ComponentLink1Description: 供应商链接; ComponentLink1URL: http://www.szlcsc.com/product/details_26562.html; Package: 0603; Supplier: LC; SuppliersPartNumber: C25819
R2 R10 R12 R13 = 0603 10KΩ (1002) 1%: 贴片电阻; ComponentLink1Description: 供应商链接; ComponentLink1URL: http://www.szlcsc.com/product/details_26547.html; Package: 0603; Supplier: LC; SuppliersPartNumber: C25804
R3 = 0603 130KΩ (1303) 1%: 贴片电阻; ComponentLink1Description: 供应商链接; ComponentLink1URL: http://www.szlcsc.com/product/details_23522.html; Package: 0603; Supplier: LC; SuppliersPartNumber: C22795
R4 = 0603 24KΩ (2402) 1%: 贴片电阻; ComponentLink1Description: 供应商链接; ComponentLink1URL: http://www.szlcsc.com/product/details_24085.html; Package: 0603; Supplier: LC; SuppliersPartNumber: C23352
R5 R7 R8 R14 R15#2 R16-R25 R52-R58 R63 = 0603 1KΩ (1001) 1%: 贴片电阻; ComponentLink1Description: 供应商链接; ComponentLink1URL: http://www.szlcsc.com/product/details_21904.html; Package: 0603; Supplier: LC; SuppliersPartNumber: C21190
R9 R11 = 0603 330Ω (3300) 1%: 贴片电阻; ComponentLink1Description: 供应商链接; ComponentLink1URL: http://www.szlcsc.com/product/details_23865.html; Package: 0603; Supplier: LC; SuppliersPartNumber: C23138
R15#1 = Res2: Resistor; Published: 8-Jun-2000; LatestRevisionDate: 17-Jul-2002; LatestRevisionNote: Re-released for DXP Platform.; PackageReference: AXIAL-0.4; Publisher: Altium Limited; Value: 47KΩ (4702) ±1%
R26-R37 R46-R51 = 1206 4.7KΩ (4701) 1%: 贴片电阻; ComponentLink1Description: 供应商链接; ComponentLink1URL: http://www.szlcsc.com/product/details_18624.html; Package: 1206; Supplier: LC; SuppliersPartNumber: C17936
R38-R45 = 0603 6.8KΩ (6801) 1%: 贴片电阻; ComponentLink1Description: 供应商链接; ComponentLink1URL: http://www.szlcsc.com/product/details_23939.html; Package: 0603; Supplier: LC; SuppliersPartNumber: C23212
R59-R62 R64 R65 = 0603 220Ω (2200) 1%: 贴片电阻; ComponentLink1Description: 供应商链接; ComponentLink1URL: http://www.szlcsc.com/product/details_23689.html; Package: 0603; Supplier: LC; SuppliersPartNumber: C22962
R66 = 0603 4.7KΩ (4701) 1%: 贴片电阻; ComponentLink1Description: 供应商链接; ComponentLink1URL: http://www.szlcsc.com/product/details_23889.html; Package: 0603; Supplier: LC; SuppliersPartNumber: C23162
R67 R69 R70 = 0603 2.2KΩ (2201) 1%: 贴片电阻; ComponentLink1Description: 供应商链接; ComponentLink1URL: http://www.szlcsc.com/product/details_4597.html; Package: 0603; Supplier: LC; SuppliersPartNumber: C4190
R68 = 0805 2KΩ (2001) 1%: 贴片电阻; ComponentLink1Description: 供应商链接; ComponentLink1URL: http://www.szlcsc.com/product/details_18292.html; Package: 0805; Supplier: LC; SuppliersPartNumber: C17604
R71 R73-R76 = 0603 100KΩ (1003) 1%: 贴片电阻; ComponentLink1Description: 供应商链接; ComponentLink1URL: http://www.szlcsc.com/product/details_26546.html; Package: 0603; Supplier: LC; SuppliersPartNumber: C25803
R72 = 0603 510Ω (5100) 1%: 贴片电阻; ComponentLink1Description: 供应商链接; ComponentLink1URL: http://www.szlcsc.com/product/details_23920.html; Package: 0603; Supplier: LC; SuppliersPartNumber: C23193
R77 = 0603 0Ω (0R0) 1%: 贴片电阻; ComponentLink1Description: 供应商链接; ComponentLink1URL: http://www.szlcsc.com/product/details_21903.html; Package: 0603; Supplier: LC; SuppliersPartNumber: C21189
S1 S2 = SW-PB: Switch; Published: 24-Mar-1999; LatestRevisionDate: 17-Jul-2002; LatestRevisionNote: Re-released for DXP Platform.; PackageReference: SPST-2; Publisher: Altium Limited
SB1 = Circuit Breaker: Solder: NO; Published: 24-Mar-1999; Revision: July-2002: Re-released for DXP Platform.; Publisher: Altium Limited
U1 = MP2451DT-LF-Z: DC-DC芯片; ComponentLink1Description: 供应商链接; ComponentLink1URL: http://www.szlcsc.com/product/details_14780.html; Package: SOT-23-6; Supplier: LC; SuppliersPartNumber: C14123
U2 = FT232RL
U3 = EEPROM/AT24C256C-SSHL-T_[C6482]: EEPROM; ComponentLink1Description: 供应商链接; ComponentLink1URL: http://www.szlcsc.com/product/details_6947.html; Package: SOIC-8_150mil; Supplier: LC; SuppliersPartNumber: C6482
U4-U15 U17 U19-U21 U23 U24 = EL357N(B)(TA)-G: 贴片光耦; ComponentLink1Description: 供应商链接; ComponentLink1URL: http://www.szlcsc.com/product/details_7114.html; Package: SOP-4_P2.54; Supplier: LC; SuppliersPartNumber: C6649
U16 = ULN2803ADW: 大电流驱动; ComponentLink1Description: 供应商链接; ComponentLink1URL: http://www.szlcsc.com/product/details_10213.html; Package: SOIC-18_300mil; Supplier: LC; SuppliersPartNumber: C9683
U22 = 74HC04
USB_TypeB1 = USB-6
VR1 = SOT-223 AMS1117-3.3: 低压差线性稳压(LDO); ComponentLink1Description: 供应商链接; ComponentLink1URL: http://www.szlcsc.com/product/details_6652.html; Package: SOT-223; Supplier: LC; SuppliersPartNumber: C6186
Y1 = SMD-5032_2P 8MHz 20ppm 20pF: 贴片晶振; ComponentLink1Description: 供应商链接; ComponentLink1URL: http://www.szlcsc.com/product/details_117214.html; Package: SMD-5032_2P; Supplier: LC; SuppliersPartNumber: C115962